# EAGLE design BSK4new (EAGLE 9.4.2)
ESKD_DESCRIPTION1: 207|235|224|242|224|32|193|209|202|52; ESKD_DESCRIPTION2: 241|245|229|236|224|32|253|235|229|234|242|240|232|247|229|241|234|224|255; ESKD_DESCRIPTION3: 239|240|232|237|246|232|239|232|224|235|252|237|224|255; ESKD_NUMBER: 67|67|83|49|46|50|53|48|48|45|48|221|51; ESKD_NUMBER_SHEET: 49; ESKD_SHEETS: 49
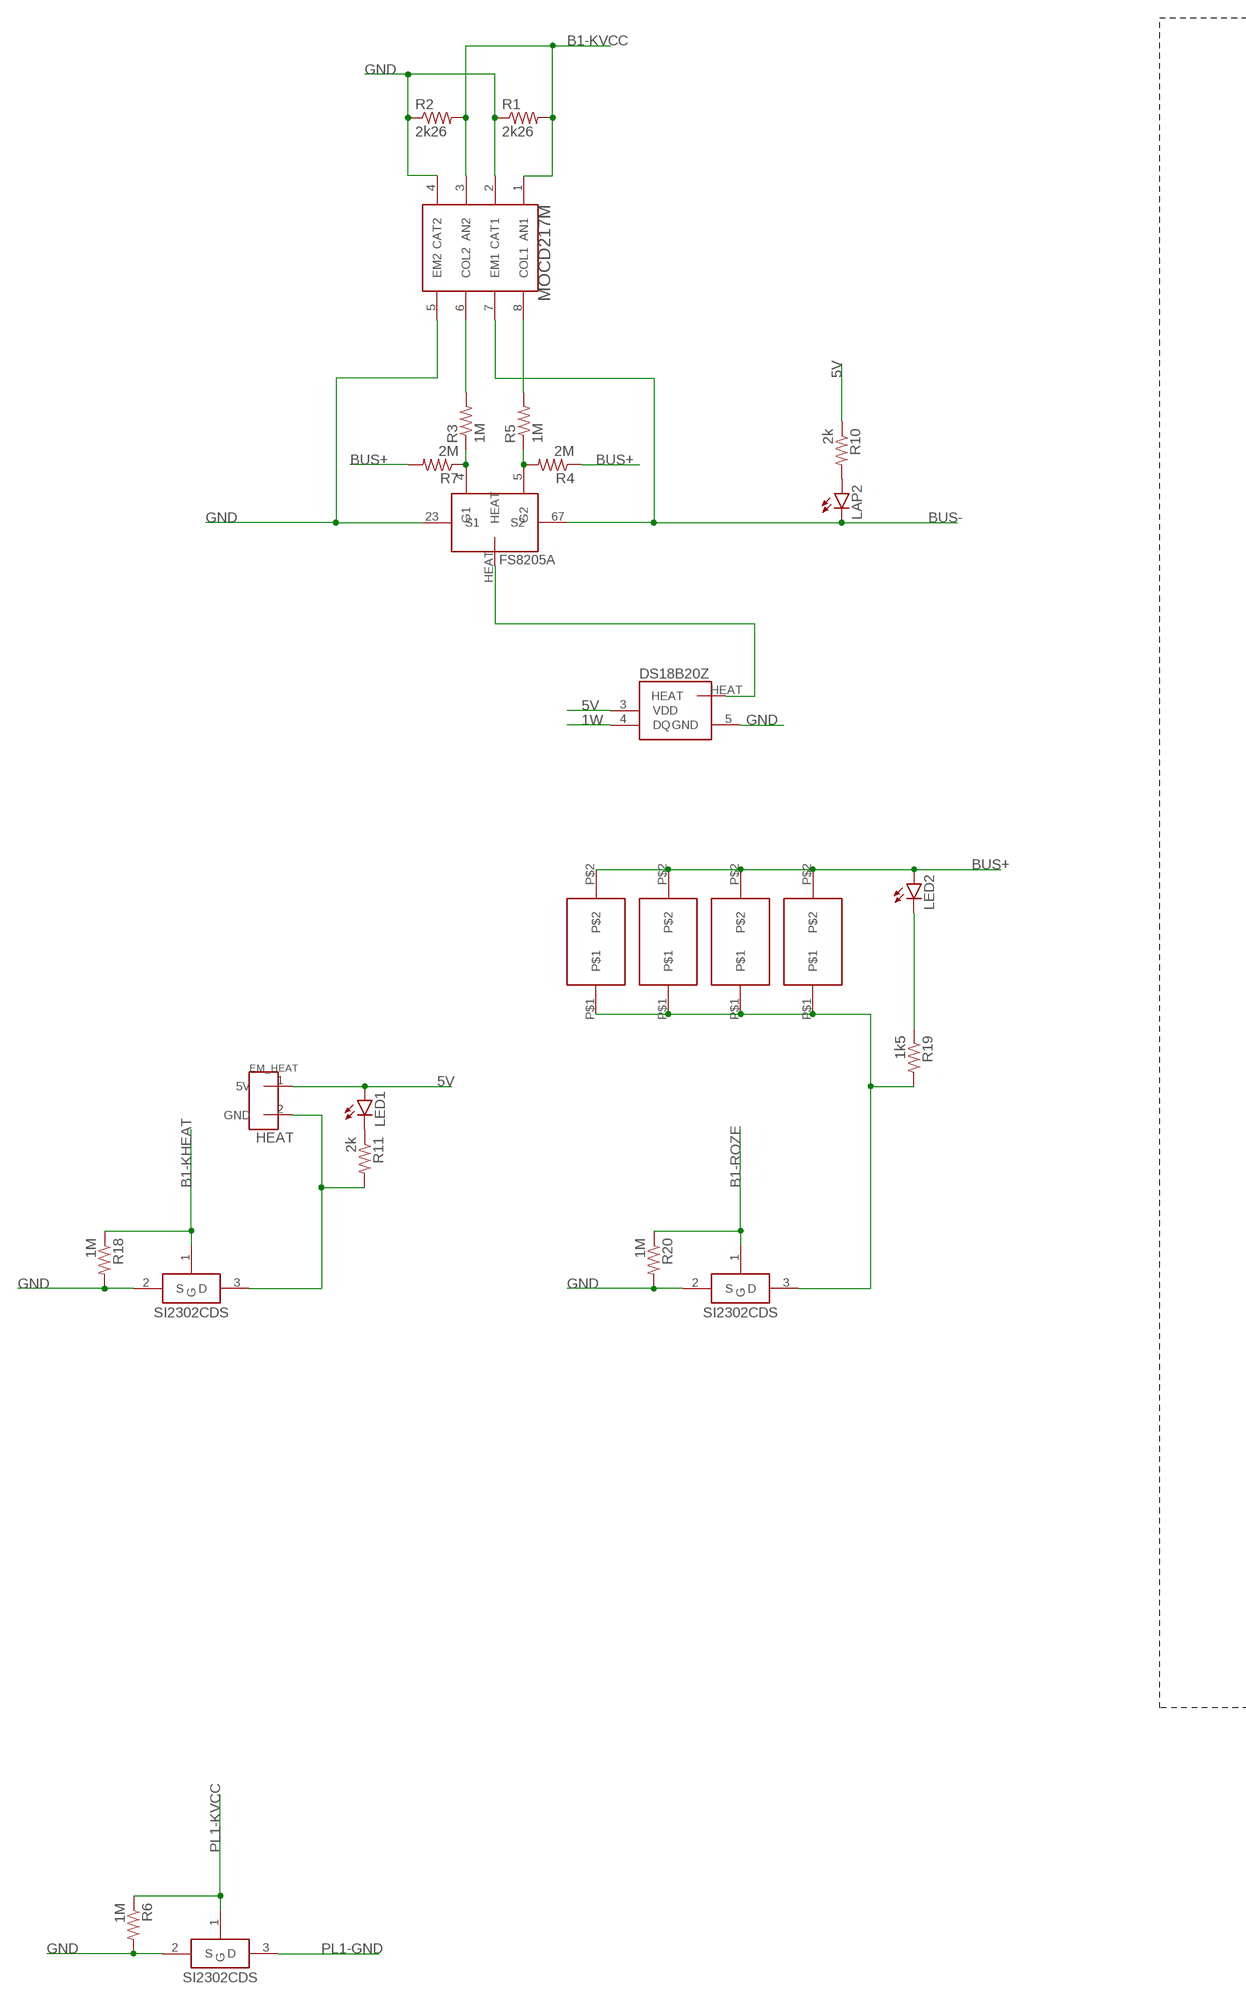
[diagram p0: schematic, sheet 1, part 1 of 2]
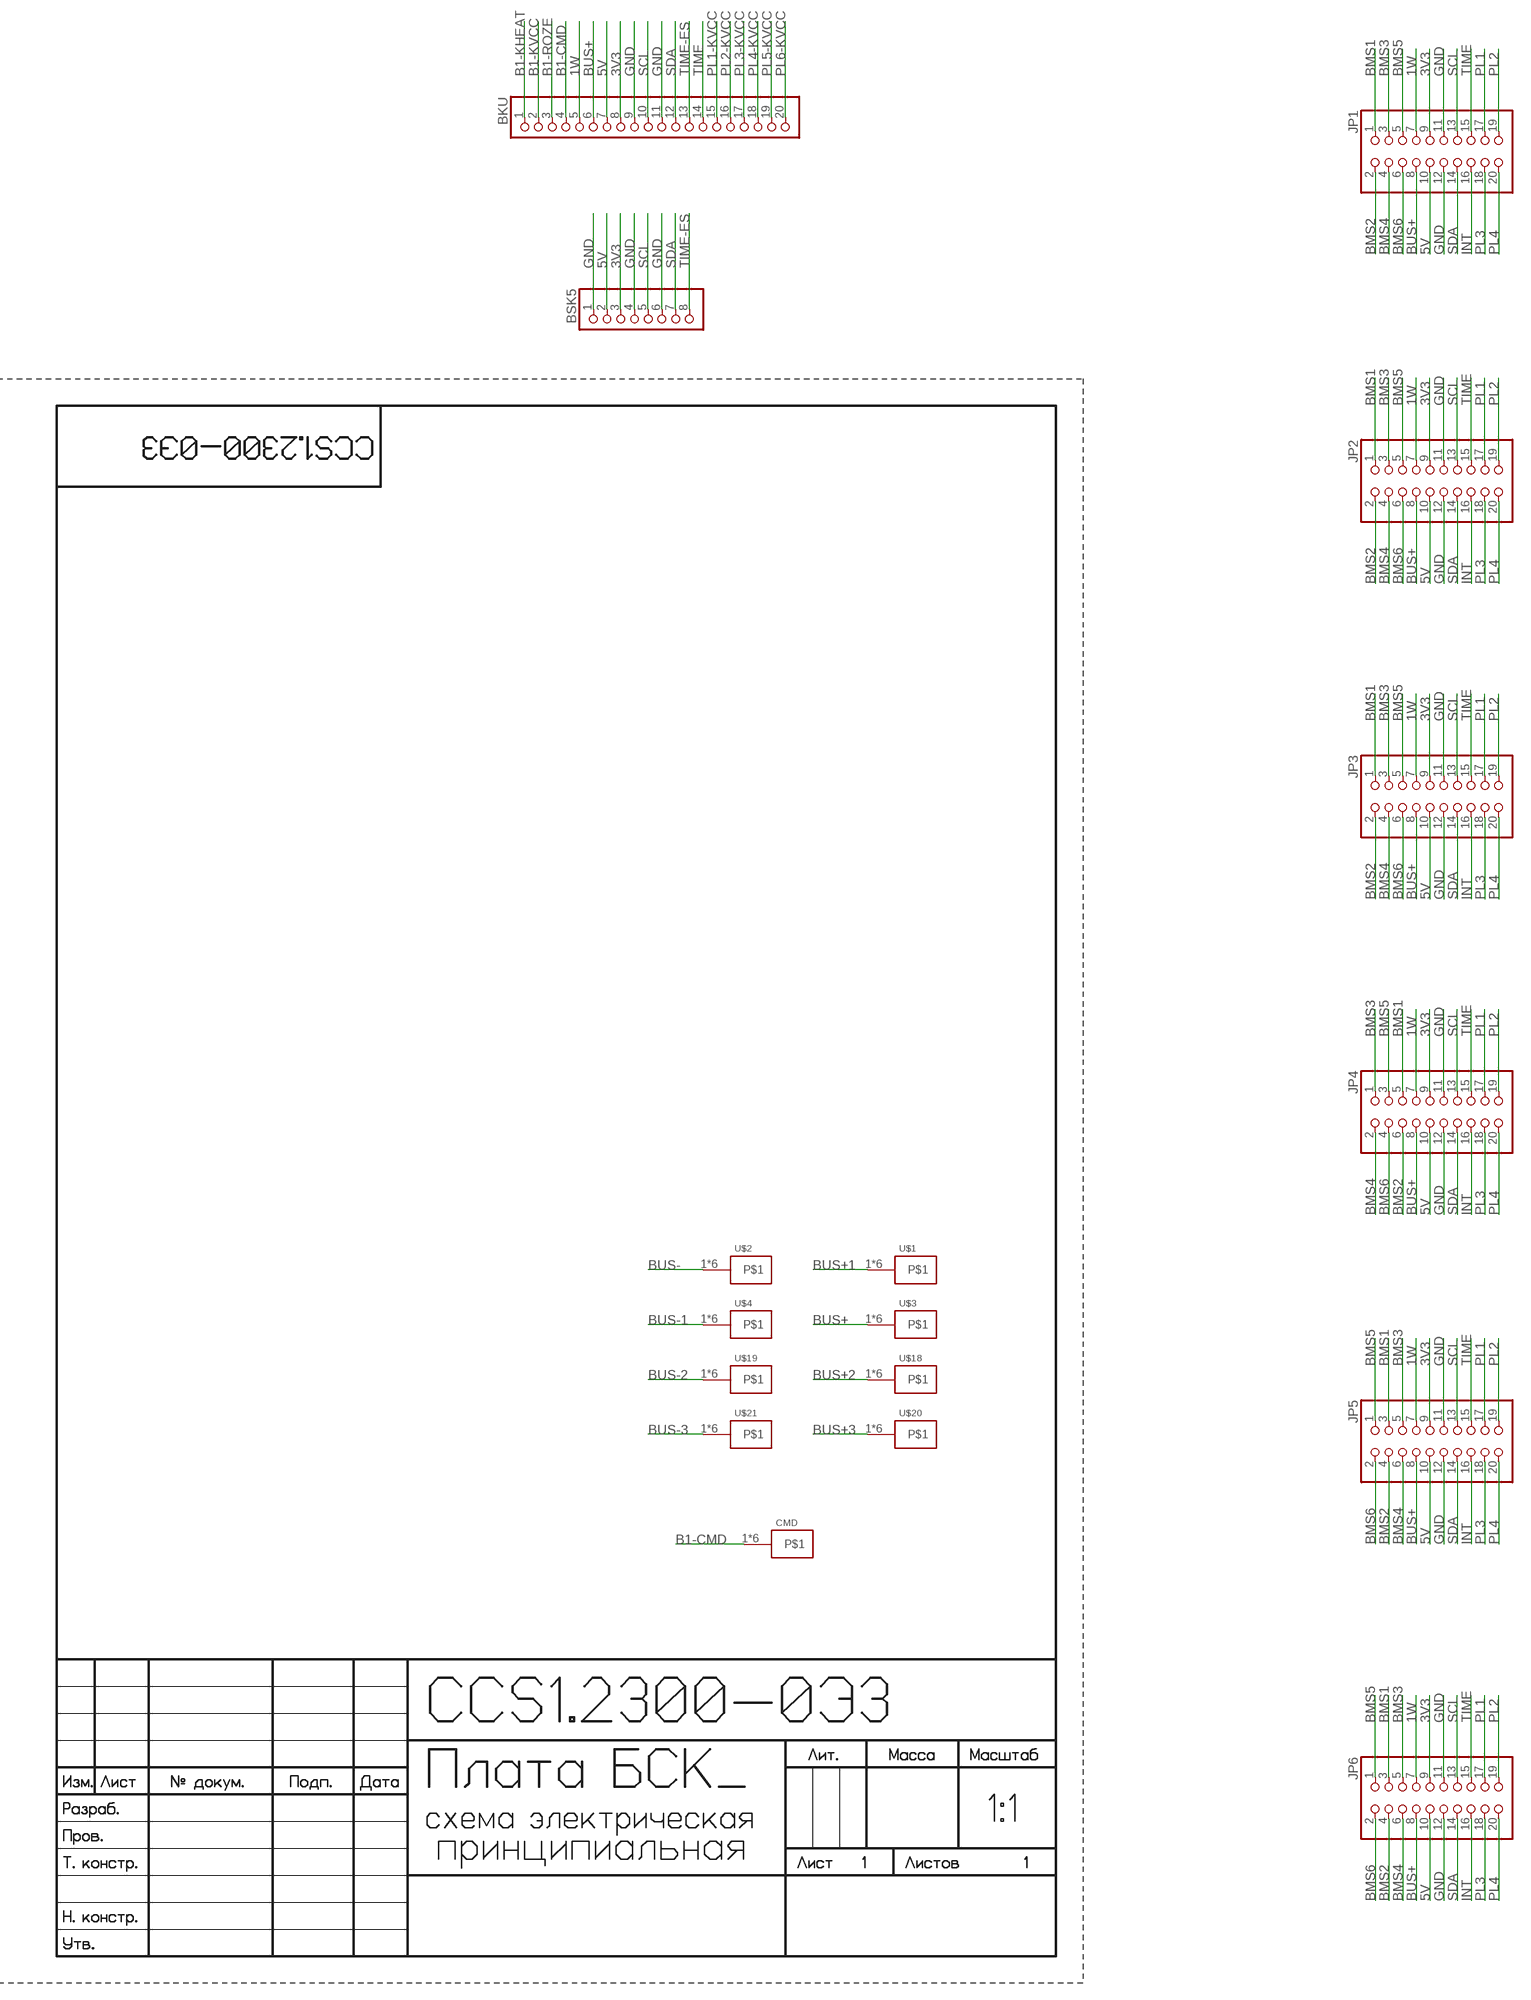
[diagram p1: schematic, sheet 1, part 2 of 2]

## Parts
BKU  PINHD-1X20  [1X20]
BSK5  PINHD-1X8  [1X08]
CMD  KCONNECTQUAD  [KCONNECT_QUAD]
DS18B20Z  DS18B20Z  [DS18B20Z]
JP1  PINHD-2X10  [2X10]
JP2  PINHD-2X10  [2X10]
JP3  PINHD-2X10  [2X10]
JP4  PINHD-2X10  [2X10]
JP5  PINHD-2X10  [2X10]
JP6  PINHD-2X10  [2X10]
LAP2  LAP4-BOTTOM  [P47F-BOTTOM]
LED1  LEDCHIPLED_0603  [CHIPLED_0603]
LED2  LEDCHIPLED_0603  [CHIPLED_0603]
R1  2k26  R-US_R0603  [R0603]
R2  2k26  R-US_R0603  [R0603]
R3  1M  R-US_R0603  [R0603]
R4  2M  R-US_R0603  [R0603]
R5  1M  R-US_R0603  [R0603]
R6  1M  R-US_R0603  [R0603]
R7  2M  R-US_R0603  [R0603]
R10  2k  R-US_R0603  [R0603]
R11  2k  R-US_R0603  [R0603]
R18  1M  R-US_R0603  [R0603]
R19  1k5  R-US_R0603  [R0603]
R20  1M  R-US_R0603  [R0603]
U$1  KCONNECT  [KCONNECT]
U$2  KCONNECT  [KCONNECT]
U$3  KCONNECT  [KCONNECT]
U$4  KCONNECT  [KCONNECT]
U$5  SI2302CDS  [SOT23-3]
U$17  FS8205A+  [FS8205A+]
U$18  KCONNECT  [KCONNECT]
U$19  KCONNECT  [KCONNECT]
U$20  KCONNECT  [KCONNECT]
U$21  KCONNECT  [KCONNECT]
U$22  MOCD217M  [SOIC8]
U$23  SI2302CDS  [SOT23-3]
U$24  EM_HEAT  [EM_HEAT]
U$25  SI2302CDS  [SOT23-3]
U$27  GRAFITGRAFIT3_1  [GRAFIT3_1]
U$28  GRAFITGRAFIT3_1  [GRAFIT3_1]
U$29  GRAFITGRAFIT3_1  [GRAFIT3_1]
U$30  GRAFITGRAFIT3_1  [GRAFIT3_1]

## Nets
1W: BKU.5 DS18B20Z.4(DQ) JP1.7 JP2.7 JP3.7 JP4.7 JP5.7 JP6.7
3: R11.2 U$23.3(D) U$24.2(GND)
3V3: BKU.8 BSK5.3 JP1.9 JP2.9 JP3.9 JP4.9 JP5.9 JP6.9
4: R19.2 U$25.3(D) U$27.P$1 U$28.P$1 U$29.P$1 U$30.P$1
5V: BKU.7 BSK5.2 DS18B20Z.3(VDD) JP1.10 JP2.10 JP3.10 JP4.10 JP5.10 JP6.10 LED1.A R10.1 U$24.1(5V)
B1-CMD: BKU.4 CMD.1 CMD.2 CMD.3 CMD.4 CMD.P$1 CMD.P$2
B1-KHEAT: BKU.1 R18.1 U$23.1(G)
B1-KVCC: BKU.2 R1.2 R2.2 U$22.1(AN1) U$22.3(AN2)
B1-ROZE: BKU.3 R20.1 U$25.1(G)
BMS1: JP1.1 JP2.1 JP3.1 JP4.5 JP5.3 JP6.3
BMS2: JP1.2 JP2.2 JP3.2 JP4.6 JP5.4 JP6.4
BMS3: JP1.3 JP2.3 JP3.3 JP4.1 JP5.5 JP6.5
BMS4: JP1.4 JP2.4 JP3.4 JP4.2 JP5.6 JP6.6
BMS5: JP1.5 JP2.5 JP3.5 JP4.3 JP5.1 JP6.1
BMS6: JP1.6 JP2.6 JP3.6 JP4.4 JP5.2 JP6.2
BUS+: BKU.6 JP1.8 JP2.8 JP3.8 JP4.8 JP5.8 JP6.8 LED2.A R4.1 R7.2 U$3.1 U$3.2 U$3.3 U$3.4 U$3.P$1 U$3.P$2 U$27.P$2 U$28.P$2 U$29.P$2 U$30.P$2
BUS+1: U$1.1 U$1.2 U$1.3 U$1.4 U$1.P$1 U$1.P$2
BUS+2: U$18.1 U$18.2 U$18.3 U$18.4 U$18.P$1 U$18.P$2
BUS+3: U$20.1 U$20.2 U$20.3 U$20.4 U$20.P$1 U$20.P$2
BUS-: LAP2.C U$2.1 U$2.2 U$2.3 U$2.4 U$2.P$1 U$2.P$2 U$17.67(S2) U$22.7(EM1)
BUS-1: U$4.1 U$4.2 U$4.3 U$4.4 U$4.P$1 U$4.P$2
BUS-2: U$19.1 U$19.2 U$19.3 U$19.4 U$19.P$1 U$19.P$2
BUS-3: U$21.1 U$21.2 U$21.3 U$21.4 U$21.P$1 U$21.P$2
GND: BKU.9 BKU.11 BSK5.1 BSK5.4 BSK5.6 DS18B20Z.5(GND) JP1.11 JP1.12 JP2.11 JP2.12 JP3.11 JP3.12 JP4.11 JP4.12 JP5.11 JP5.12 JP6.11 JP6.12 R1.1 R2.1 R6.2 R18.2 R20.2 U$5.2(S) U$17.23(S1) U$22.2(CAT1) U$22.4(CAT2) U$22.5(EM2) U$23.2(S) U$25.2(S)
INT: JP1.16 JP2.16 JP3.16 JP4.16 JP5.16 JP6.16
N$1: R4.2 R5.1 U$17.5(G2)
N$2: LED1.C R11.1
N$3: LED2.C R19.1
N$4: DS18B20Z.HEAT U$17.HEAT
N$27: R3.1 R7.1 U$17.4(G1)
N$28: LAP2.A R10.2
OC2: R3.2 U$22.6(COL2)
OD2: R5.2 U$22.8(COL1)
PL1: JP1.17 JP2.17 JP3.17 JP4.17 JP5.17 JP6.17
PL1-GND: U$5.3(D)
PL1-KVCC: BKU.15 R6.1 U$5.1(G)
PL2: JP1.19 JP2.19 JP3.19 JP4.19 JP5.19 JP6.19
PL2-KVCC: BKU.16
PL3: JP1.18 JP2.18 JP3.18 JP4.18 JP5.18 JP6.18
PL3-KVCC: BKU.17
PL4: JP1.20 JP2.20 JP3.20 JP4.20 JP5.20 JP6.20
PL4-KVCC: BKU.18
PL5-KVCC: BKU.19
PL6-KVCC: BKU.20
SCL: BKU.10 BSK5.5 JP1.13 JP2.13 JP3.13 JP4.13 JP5.13 JP6.13
SDA: BKU.12 BSK5.7 JP1.14 JP2.14 JP3.14 JP4.14 JP5.14 JP6.14
TIME: BKU.14 JP1.15 JP2.15 JP3.15 JP4.15 JP5.15 JP6.15
TIME-ES: BKU.13 BSK5.8

## Notes on the sheet
- HEAT

## Library data of the parts
BKU = pinheadCS:PINHD-1X20: PIN HEADER
BSK5 = pinheadCS:PINHD-1X8: PIN HEADER
CMD U$1-U$4 U$18-U$21 = CanCubeSat:KCONNECT
DS18B20Z = CanCubeSat:DS18B20Z
JP1-JP6 = pinheadCS:PINHD-2X10: PIN HEADER
LAP2 = led:*P4: PointLED® Enhanced Thinfilm LED TOP & BOTTOM mount LS P47F, LR P47F, LA P47F, LY P47F, LT P4SG, LB P4SG, LW P4SG Source: http://catalog.osram-os.com .. LA_LR_LS_LY_P47F_Pb_free.pdf
LED1 LED2 = led:LED: LED OSRAM: - CHIPLED LG R971, LG N971, LY N971, LG Q971, LY Q971, LO R971, LY R971 LH N974, LH R974 LS Q976, LO Q976, LY Q976 LO Q996 - Hyper CHIPLED LW Q18S LB Q993, LB Q99A, LB R99A - SideLED LS A670, LO A670, LY A670, LG A670, LP A670 LB A673, LV A673, LT A673, LW A673 LH A674 LY A675 LS A676, LA A676, LO A676, LY A676, LW A676 LS A679, LY A679, LG A679 - Hyper Micro SIDELED® LS Y876, LA Y876, LO Y876, LY Y876 LT Y87S - SmartLED LW L88C, LW L88S LB L89C, LB L89S, LG L890 LS L89K, LO L89K, LY L89K LS L896, LA L896, LO L896, LY L896 - TOPLED LS T670, LO T670, LY T670, LG T670, LP T670 LSG T670, LSP T670, LSY T670, LOP T670, LYG T670 LG T671, LOG T671, LSG T671 LB T673, LV T673, LT T673, LW T673 LH T674 LS T676, LA T676, LO T676, LY T676, LB T676, LH T676, LSB T676, LW T676 LB T67C, LV T67C, LT T67C, LS T67K, LO T67K, LY T67K, LW E67C LS E67B, LA E67B, LO E67B, LY E67B, LB E67C, LV E67C, LT E67C LW T67C LS T679, LY T679, LG T679 LS T770, LO T770, LY T770, LG T770, LP T770 LB T773, LV T773, LT T773, LW T773 LH T774 LS E675, LA E675, LY E675, LS T675 LS T776, LA T776, LO T776, LY T776, LB T776 LHGB T686 LT T68C, LB T68C - Hyper Mini TOPLED® LB M676 - Mini TOPLED Santana® LG M470 LS M47K, LO M47K, LY M47K Source: http://www.osram.convergy.de LUXEON: - LUMILED® LXK2-PW12-R00, LXK2-PW12-S00, LXK2-PW14-U00, LXK2-PW14-V00 LXK2-PM12-R00, LXK2-PM12-S00, LXK2-PM14-U00 LXK2-PE12-Q00, LXK2-PE12-R00, LXK2-PE12-S00, LXK2-PE14-T00, LXK2-PE14-U00 LXK2-PB12-K00, LXK2-PB12-L00, LXK2-PB12-M00, LXK2-PB14-N00, LXK2-PB14-P00, LXK2-PB14-Q00 LXK2-PR12-L00, LXK2-PR12-M00, LXK2-PR14-Q00, LXK2-PR14-R00 LXK2-PD12-Q00, LXK2-PD12-R00, LXK2-PD12-S00 LXK2-PH12-R00, LXK2-PH12-S00 LXK2-PL12-P00, LXK2-PL12-Q00, LXK2-PL12-R00 Source: www.luxeon.com KINGBRIGHT: KA-3528ASYC Source: www.kingbright.com
R1-R7 R10 R11 R18-R20 = resistor:R-US_: RESISTOR, American symbol
U$5 U$23 U$25 = CanCubeSat:SI2302CDS
U$17 = CanCubeSat:FS8205A+
U$22 = CanCubeSat:MOCD217M
U$24 = CanCubeSat:EM_HEAT
U$27-U$30 = CanCubeSat:GRAFIT

## Board
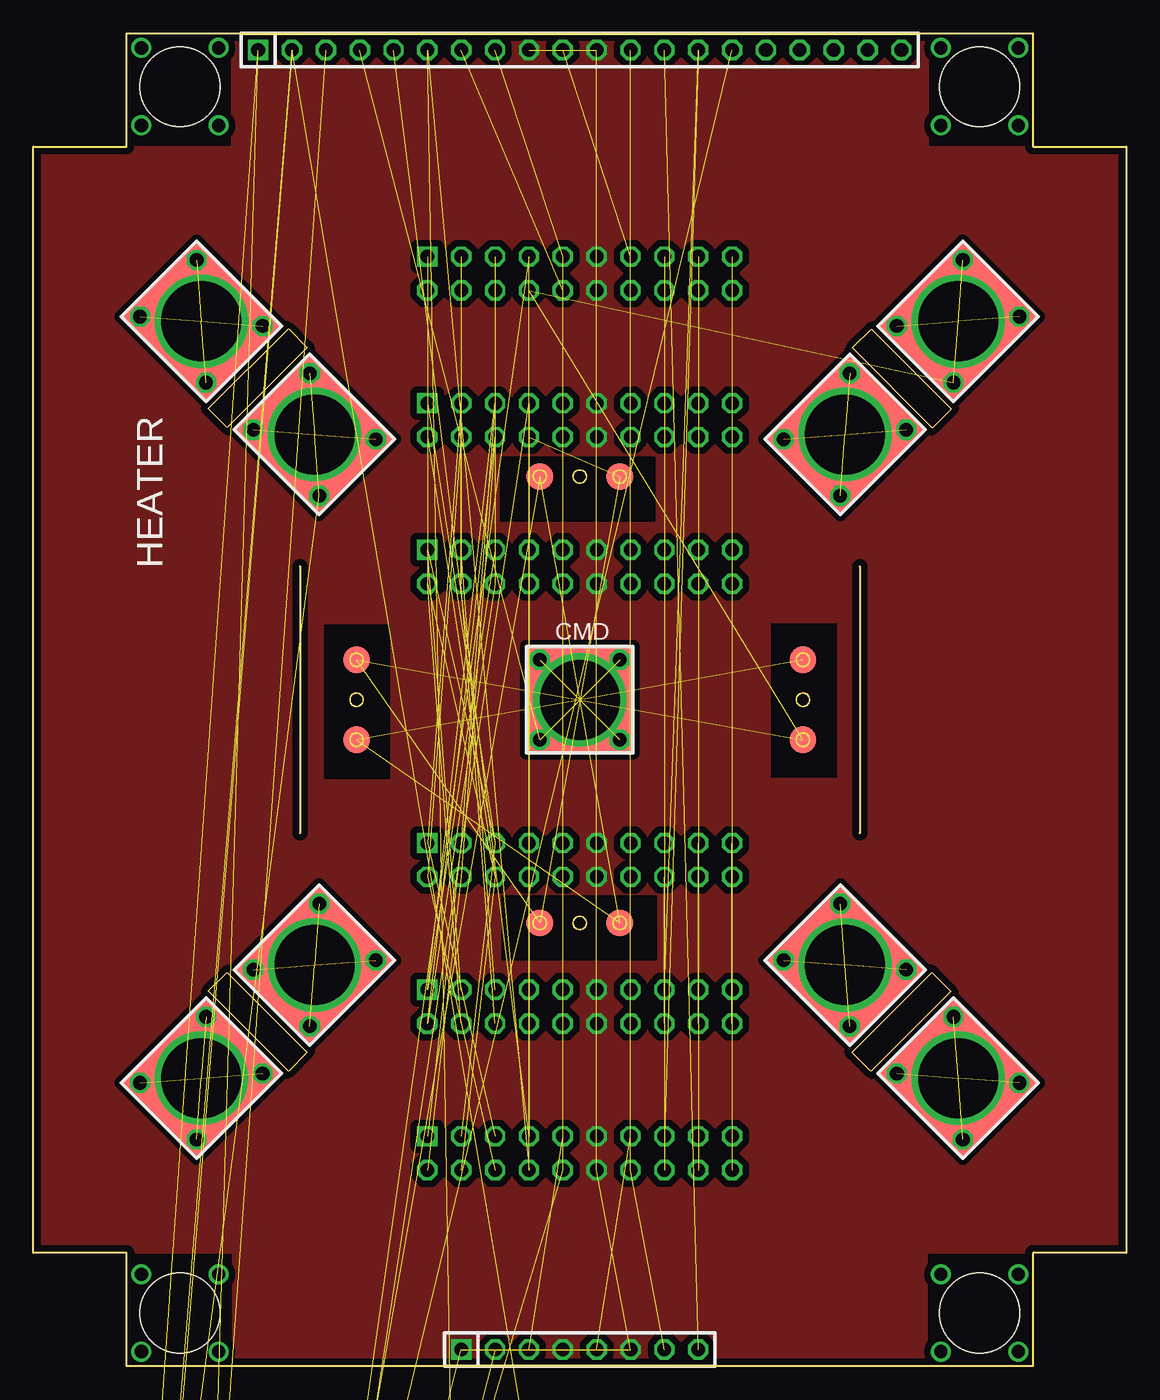
[diagram p2: board, top side]
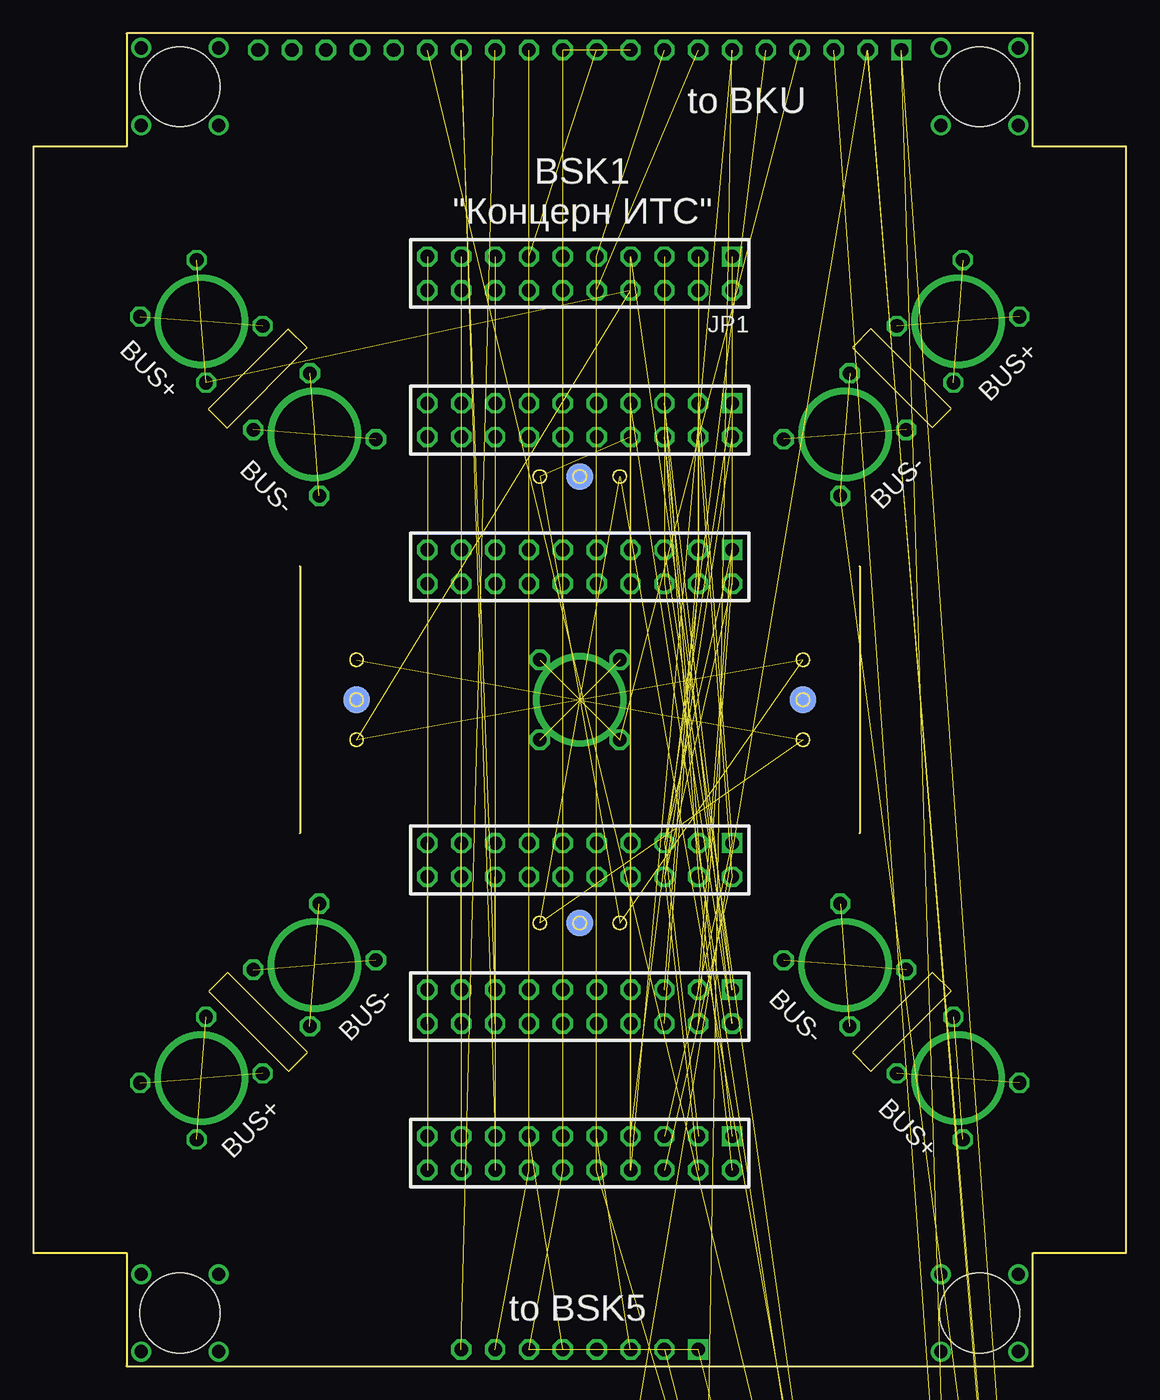
[diagram p3: board, bottom side, seen from below]

Size 82 x 100 mm. Coordinates in mm from the lower left corner, seen from the top.
Outline: 20,60 20,40
Outline: 62,60 62,40
Outline: 0,8.5 0,91.5 7,91.5 7,100 75,100 75,91.5 82,91.5 82,8.5 75,8.5 75,0 7,0 7,8.5 0,8.5
Outline: 61.41,23.54 67.42,29.55 68.84,28.13 62.83,22.12 61.41,23.54
Outline: 13.13,71.83 19.14,77.84 20.56,76.42 14.55,70.41 13.13,71.83
Outline: 67.47,70.39 61.46,76.4 62.88,77.82 68.89,71.81 67.47,70.39
Outline: 19.14,22.13 13.13,28.14 14.55,29.56 20.56,23.55 19.14,22.13
Copper layers (1*16): Top 0.035mm / dielectric 1.5mm / Bottom 0.035mm
Design rules "default *": minimum track width 0.3mm, minimum drill 0.35mm, track to track 0.2mm, track to pad 0.2mm, pad to pad 0.2mm, via to via 0.2mm, smd to smd 0.2mm, copper to edge 0.25mm, drill to drill 6mil, minimum pad ring 10mil, minimum via ring 8mil, stop-mask expansion 2mil, vias tented up to drill 0mil, thermal gap 10mil
Holes 6 mm at 11,4 71,4 71,96 11,96

### Footprints (pad centres in the part's own frame; a part is rotated, then mirrored left to right if it is on the bottom)
1X20 = drill 1.016 square: 1 -24.13,0 | drill 1.016 octagon: 2 -21.59,0; 3 -19.05,0; 4 -16.51,0; 5 -13.97,0; 6 -11.43,0; 7 -8.89,0; 8 -6.35,0; 9 -3.81,0; 10 -1.27,0; 11 1.27,0; 12 3.81,0; 13 6.35,0; 14 8.89,0; 15 11.43,0; 16 13.97,0; 17 16.51,0; 18 19.05,0; 19 21.59,0; 20 24.13,0
1X08 = drill 1.016 square: 1 -8.89,0 | drill 1.016 octagon: 2 -6.35,0; 3 -3.81,0; 4 -1.27,0; 5 1.27,0; 6 3.81,0; 7 6.35,0; 8 8.89,0
KCONNECT_QUAD = drill 1.016 octagon: 1 -3,-3; 2 -3,3; 3 3,-3; 4 3,3 | drill 6: P$1 0,0 | smd 8 x 8: P$2 0,0
DS18B20Z = smd 0.6 x 2.2: 1 -1.905,-2.6; 2 -0.635,-2.6; 3 0.635,-2.6; 4 1.905,-2.6; 5 1.905,2.6; 6 0.635,2.6; 7 -0.635,2.6; 8 -1.905,2.6 | smd 4 x 1.5: HEAT 0,0
2X10 = drill 1.016 square: 1 -11.43,-1.27 | drill 1.016 octagon: 2 -11.43,1.27; 3 -8.89,-1.27; 4 -8.89,1.27; 5 -6.35,-1.27; 6 -6.35,1.27; 7 -3.81,-1.27; 8 -3.81,1.27; 9 -1.27,-1.27; 10 -1.27,1.27; 11 1.27,-1.27; 12 1.27,1.27; 13 3.81,-1.27; 14 3.81,1.27; 15 6.35,-1.27; 16 6.35,1.27; 17 8.89,-1.27; 18 8.89,1.27; 19 11.43,-1.27; 20 11.43,1.27
P47F-BOTTOM = smd 2.6 x 2.6: A -2.45,0; C 2.45,0 | hole 2.3: 0,0
CHIPLED_0603 = smd 0.8 x 0.8: A 0,-0.75; C 0,0.75
R0603 = smd 1 x 1.1: 1 -0.85,0; 2 0.85,0
KCONNECT = drill 1.016 octagon: 1 -3,-3.5; 2 -3,3.5; 3 3,-3.5; 4 3,3.5 | drill 6: P$1 0,0 | smd 8 x 9: P$2 0,0
SOT23-3 = smd 0.56 x 0.73: 1 -0.95,-1; 2 0.95,-1; 3 0,1
FS8205A+ = smd 0.4 x 0.8: 1 -0.975,-3; 4 0.975,-3; 5 0.975,3; 8 -0.975,3 | smd 1.05 x 0.8: 23 0,-3; 67 0,3 | smd 2.5 x 2.5: HEAT 0,0
SOIC8 = smd 0.6 x 2.2: 1 -1.905,-2.6; 2 -0.635,-2.6; 3 0.635,-2.6; 4 1.905,-2.6; 5 1.905,2.6; 6 0.635,2.6; 7 -0.635,2.6; 8 -1.905,2.6
EM_HEAT = smd 2 x 4: 1 -2,0; 2 2,0
GRAFIT3_1 = smd 2 x 2 bottom: OUT 0,0 | smd 2 x 2: P$1 0,3; P$2 0,-3

### Placement (x,y rotation side)
BKU  41,98.75 0 top
BSK5  41,1.25 0 top
CMD  41,50 0 top
DS18B20Z  13.5,-68.1 0 top  (outside the outline)
JP1  41,81.98 180 bottom
JP2  41,70.98 180 bottom
JP3  41,59.98 180 bottom
JP4  41,37.98 180 bottom
JP5  41,26.98 180 bottom
JP6  41,15.98 180 bottom
LAP2  30.4,-94.9 0 top  (outside the outline)
LED1  53.1,-94.8 0 top  (outside the outline)
LED2  56.6,-94.8 0 top  (outside the outline)
R1  53.1,-106.6 0 top  (outside the outline)
R2  1.5,-111.7 0 top  (outside the outline)
R3  30.1,-111.7 0 top  (outside the outline)
R4  34,-111.7 0 top  (outside the outline)
R5  37.9,-111.7 0 top  (outside the outline)
R6  1.5,-116.6 0 top  (outside the outline)
R7  41.8,-111.7 0 top  (outside the outline)
R10  6.8,-111.7 0 top  (outside the outline)
R11  25.6,-111.7 0 top  (outside the outline)
R18  11.5,-111.7 0 top  (outside the outline)
R19  16.2,-111.7 0 top  (outside the outline)
R20  20.9,-111.7 0 top  (outside the outline)
U$1  12.61,78.39 45 top
U$2  21.09,69.91 45 top
U$3  69.39,78.39 315 top
U$4  60.91,69.91 315 top
U$5  3.6,-120.5 0 top  (outside the outline)
U$17  42.5,-94.6 0 top  (outside the outline)
U$18  12.61,21.61 135 top
U$19  21.09,30.09 135 top
U$20  69.39,21.61 225 top
U$21  60.91,30.09 225 top
U$22  4.5,-71.9 0 top  (outside the outline)
U$23  3.6,-101 0 top  (outside the outline)
U$24  47.5,-95 0 top  (outside the outline)
U$25  8.6,-101 0 top  (outside the outline)
U$27  41,66.75 90 top
U$28  41,33.25 270 top
U$29  24.25,50 180 top
U$30  57.75,50 0 top

### Tracks (layer width: path | path; a pad name or v marks a point on that pad's centre or on a via)
1W  (7 unrouted)
3  (2 unrouted)
3V3  (7 unrouted)
4  (5 unrouted)
5V  (11 unrouted)
B1-CMD  (5 unrouted)
B1-KHEAT  (2 unrouted)
B1-KVCC  (4 unrouted)
B1-ROZE  (2 unrouted)
BMS1  (5 unrouted)
BMS2  (5 unrouted)
BMS3  (5 unrouted)
BMS4  (5 unrouted)
BMS5  (5 unrouted)
BMS6  (5 unrouted)
BUS+  (18 unrouted)
BUS+1  (4 unrouted)
BUS+2  (4 unrouted)
BUS+3  (4 unrouted)
BUS-  (7 unrouted)
BUS-1  (4 unrouted)
BUS-2  (4 unrouted)
BUS-3  (4 unrouted)
GND  (29 unrouted)
  cutout Top: 12.6,71.87 14.6,69.87 21.1,76.37 19.1,78.37
  pour Top (isolate 0.5, no thermals): 0,91.5 14.9,91.5 14.9,100 67.1,100 67.1,91.5 82,91.5 82,8.5 67,8.5 67,0 15,0 15,8.4 14.9,8.5 0,8.5
GND1
  cutout Top (no thermals): 46.7,30.5 35.2,30.5 35.2,35.3 46.7,35.3
GND2
  cutout Top (no thermals): 55.4,44.2 55.4,55.7 60.2,55.7 60.2,44.2
GND3
  cutout Top (no thermals): 21.9,44.1 21.9,55.6 26.7,55.6 26.7,44.1
GND4
  cutout Top (no thermals): 46.6,63.4 35.1,63.4 35.1,68.2 46.6,68.2
HEAT1
  cutout Top: 60.87,23.59 62.87,21.59 69.37,28.09 67.37,30.09
HEAT2
  cutout Top: 67.42,69.85 69.42,71.85 62.92,78.35 60.92,76.35
HEAT3
  cutout Top: 19.1,21.6 21.1,23.6 14.6,30.1 12.6,28.1
INT  (5 unrouted)
N$1  (2 unrouted)
N$2  (1 unrouted)
N$3  (1 unrouted)
N$4  (1 unrouted)
N$5  (via drill 1)
  other vias: 68.1,6.9
N$6  (via drill 1)
  other vias: 68.1,1.1
N$7  (via drill 1)
  other vias: 73.9,1.1
N$8  (via drill 1)
  other vias: 73.9,6.9
N$9  (via drill 1)
  other vias: 8.1,98.9
N$10  (via drill 1)
  other vias: 8.1,93.1
N$11  (via drill 1)
  other vias: 8.1,6.9
N$12  (via drill 1)
  other vias: 8.1,1.1
N$13  (via drill 1)
  other vias: 13.9,1.1
N$14  (via drill 1)
  other vias: 13.9,6.9
N$15  (via drill 1)
  other vias: 13.9,93.1
N$16  (via drill 1)
  other vias: 13.9,98.9
N$17  (via drill 1)
  other vias: 68.1,98.9
N$18  (via drill 1)
  other vias: 68.1,93.1
N$19  (via drill 1)
  other vias: 73.9,93.1
N$20  (via drill 1)
  other vias: 73.9,98.9
N$27  (2 unrouted)
N$28  (1 unrouted)
OC2  (1 unrouted)
OD2  (1 unrouted)
PL1  (5 unrouted)
PL1-KVCC  (2 unrouted)
PL2  (5 unrouted)
PL3  (5 unrouted)
PL4  (5 unrouted)
SCL  (7 unrouted)
SDA  (7 unrouted)
TIME  (6 unrouted)
TIME-ES  (1 unrouted)

### Text on the board
tNames: HEATER
bNames: to BKU | BSK1 / "Концерн ИТС" | BUS+ | BUS+ | BUS- | BUS- | BUS- | BUS- | BUS+ | BUS+ | to BSK5